# EAGLE design v_1.0 (EAGLE 9.4.2)
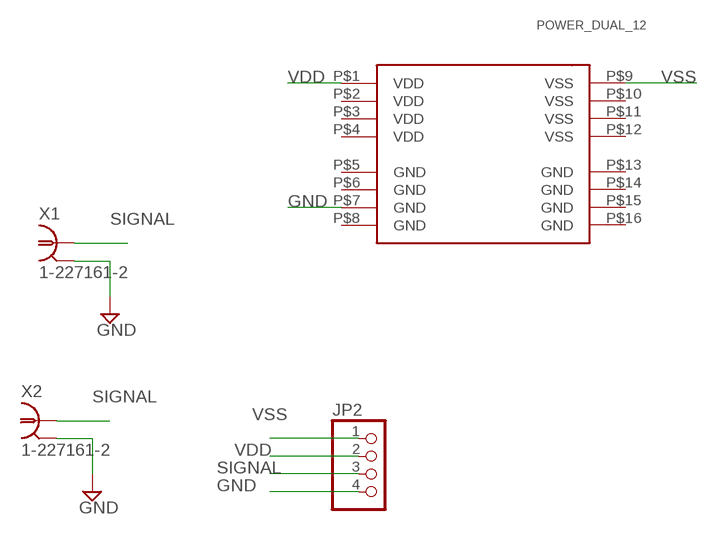
[diagram p0: schematic, sheet 1]

## Parts
JP2  PINHD-1X4  [1X04]
U$1  POWER_DUAL_12  [MODULE_4X8]
X1  1-227161-2  [AMP_227161]
X2  1-227161-2  [AMP_227161]

## Nets
GND: JP2.4 U$1.P$7(GND) X1.2 X2.2
SIGNAL: JP2.3 X1.1 X2.1
VDD: JP2.2 U$1.P$1(VDD)
VSS: JP2.1 U$1.P$9(VSS)
Unconnected: U$1.P$2(VDD) U$1.P$3(VDD) U$1.P$4(VDD) U$1.P$5(GND) U$1.P$6(GND) U$1.P$8(GND) U$1.P$10(VSS) U$1.P$11(VSS) U$1.P$12(VSS) U$1.P$13(GND) U$1.P$14(GND) U$1.P$15(GND) U$1.P$16(GND)

## Library data of the parts
JP2 = pinhead:PINHD-1X4: PIN HEADER
U$1 = uguz_cEGG:POWER_DUAL_12
X1 X2 = con-coax:?227161*: JACK, RIGHT ANGLE, 50 OHM, PCB, BNC Source: amp_227161.pdf; OC_FARNELL: unknown; OC_NEWARK: unknown

## Board
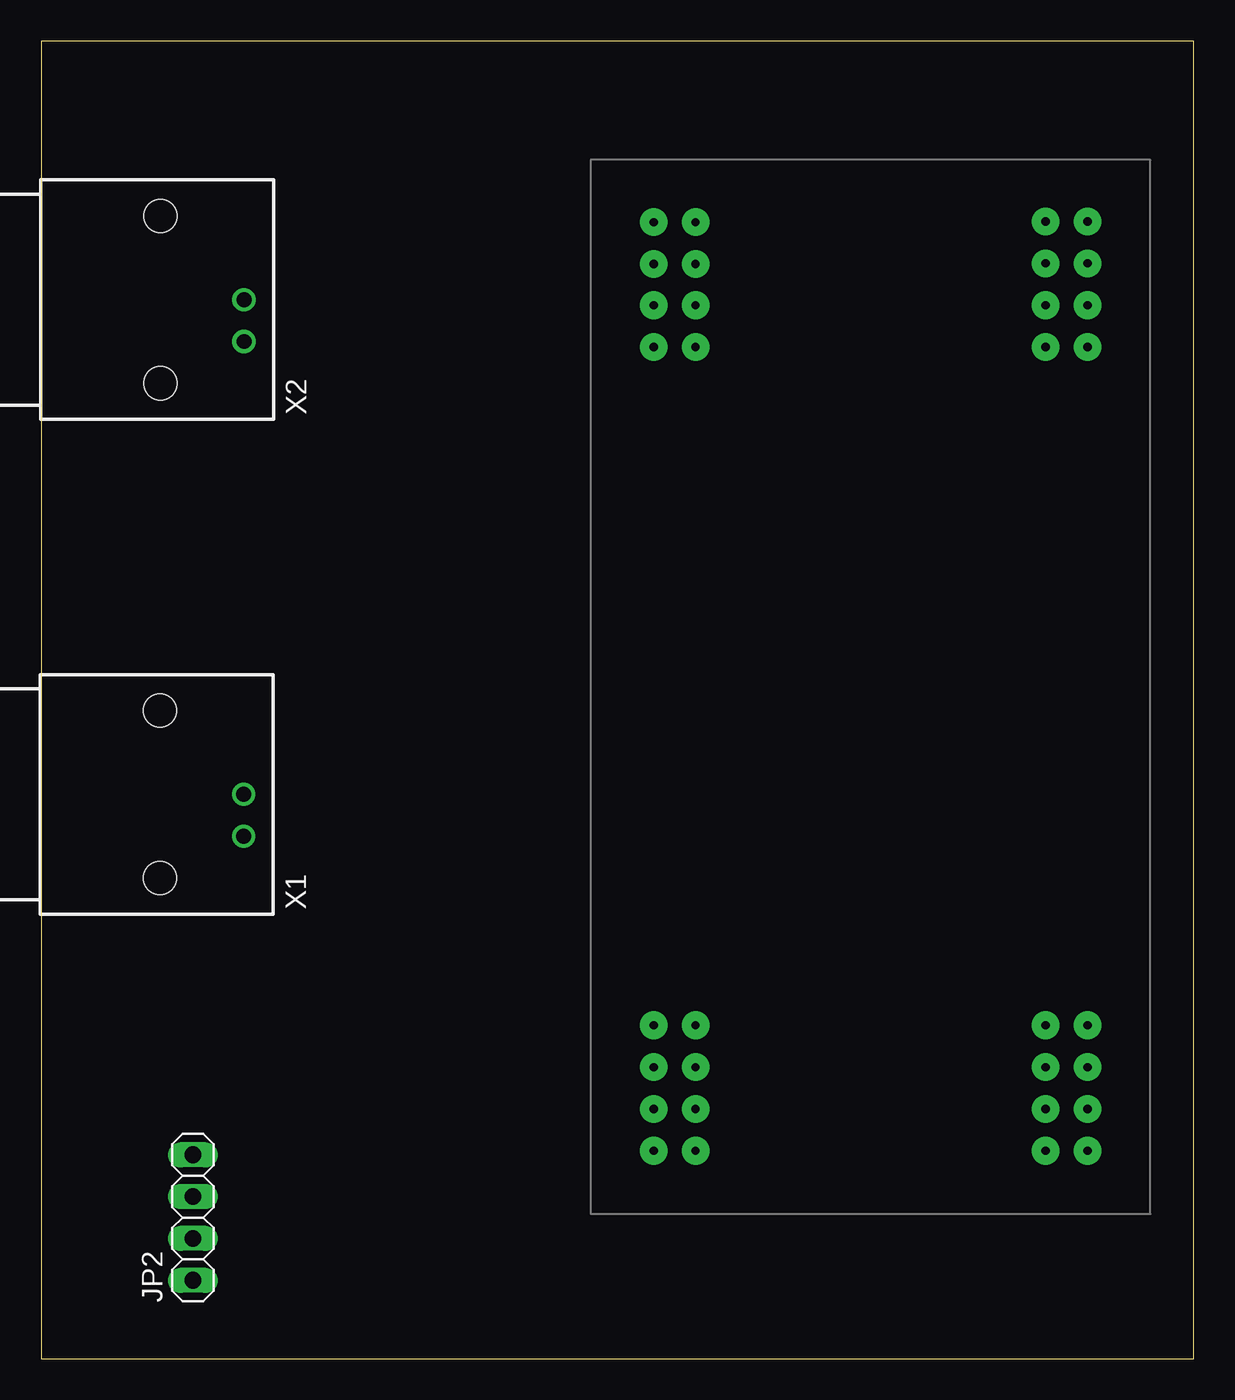
[diagram p1: board, top side]
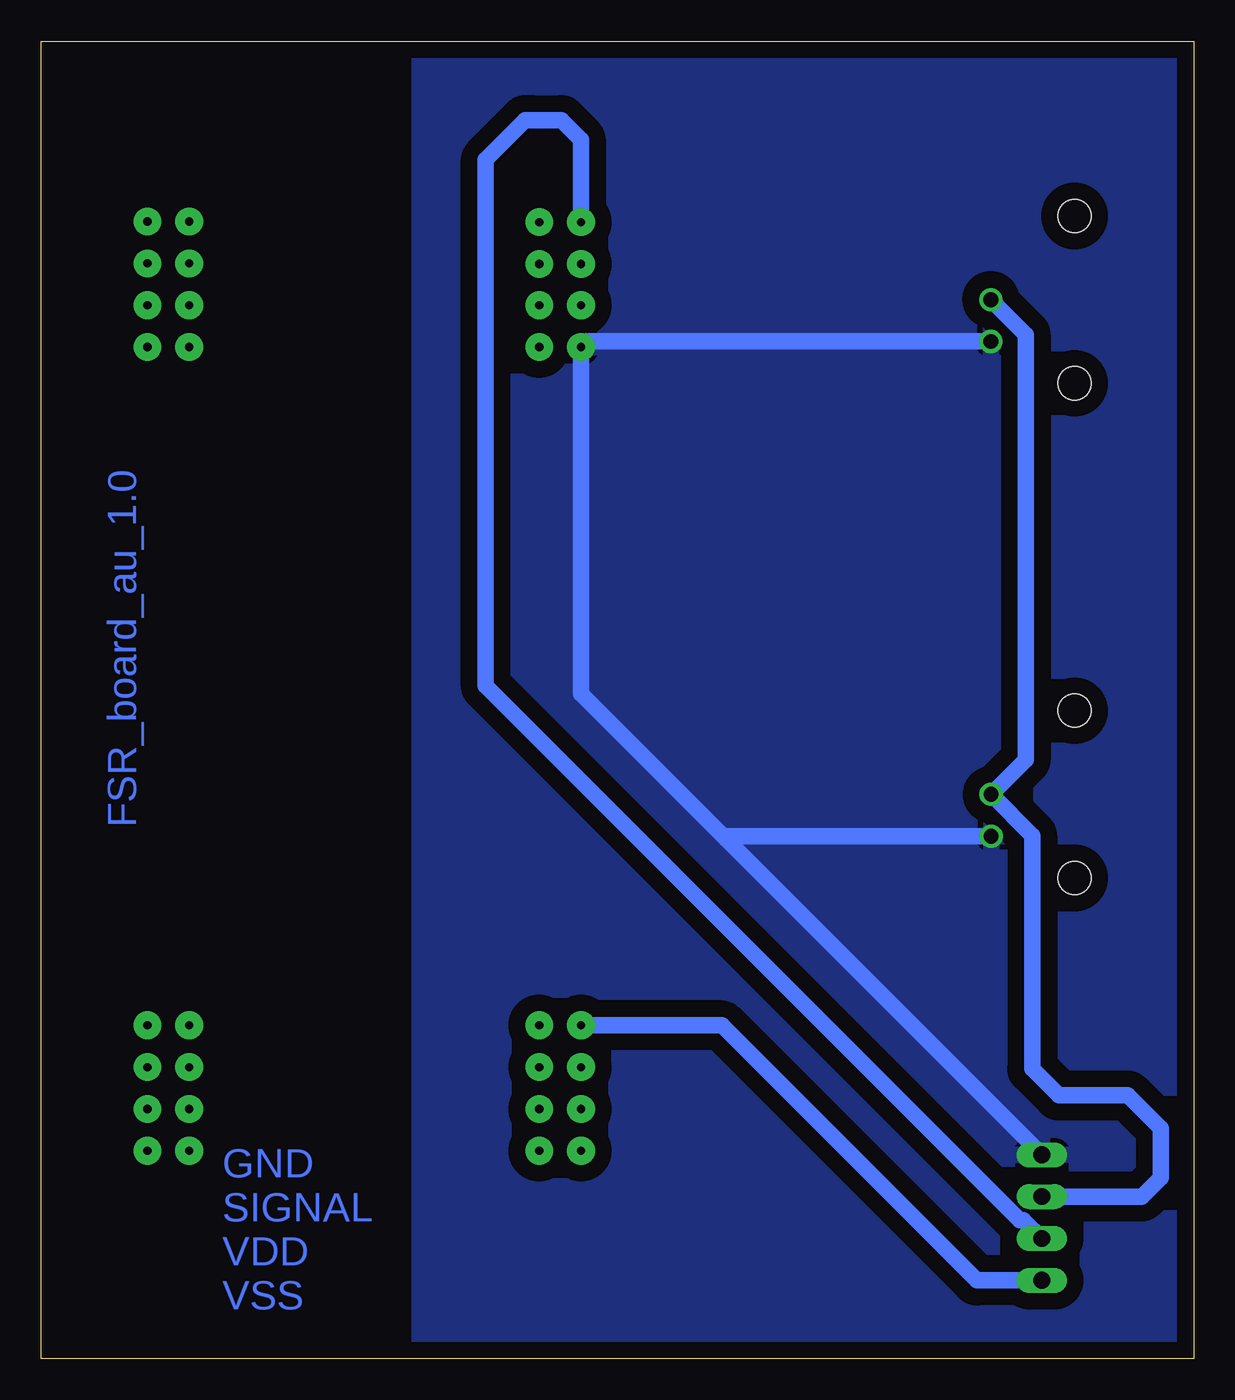
[diagram p2: board, bottom side, seen from below]

Size 70 x 80 mm. Coordinates in mm from the lower left corner, seen from the top.
Outline: 0,0 70,0 70,80 0,80 0,0
Copper layers (1*16): Top 0.035mm / dielectric 1.5mm / Bottom 0.035mm
Design rules "default": minimum track width 6mil, minimum drill 0.35mm, track to track 6mil, track to pad 6mil, pad to pad 6mil, via to via 6mil, smd to smd 6mil, copper to edge 40mil, drill to drill 6mil, minimum pad ring 10mil, minimum via ring 8mil, stop-mask expansion 4mil, vias tented up to drill 0mil, thermal gap 10mil

### Footprints (pad centres in the part's own frame; a part is rotated, then mirrored left to right if it is on the bottom)
1X04 = drill 1.016 long: 1 -3.81,0; 2 -1.27,0; 3 1.27,0; 4 3.81,0
MODULE_4X8 = drill 0.5 pad 1.676: P$1 -28.21,-13.17; P$2 -28.21,-10.63; P$3 -25.67,-13.17; P$4 -25.67,-10.63; P$5 -23.17,-13.17; P$6 -23.17,-10.63; P$7 -20.63,-13.17; P$8 -20.63,-10.63; P$9 20.55,-13.17; P$10 20.55,-10.63; P$11 23.09,-13.17; P$12 23.09,-10.63; P$13 25.63,-13.17; P$14 25.63,-10.63; P$15 28.17,-13.17; P$16 28.17,-10.63; P$17 -28.25,10.63; P$18 -28.25,13.17; P$19 -25.71,10.63; P$20 -25.71,13.17; P$21 -23.17,10.63; P$22 -23.17,13.17; P$23 -20.63,10.63; P$24 -20.63,13.17; P$25 20.55,10.63; P$26 20.55,13.17; P$27 23.09,10.63; P$28 23.09,13.17; P$29 25.63,10.63; P$30 25.63,13.17; P$31 28.17,10.63; P$32 28.17,13.17
AMP_227161 = drill 0.9 pad 1.27: 1 0,-5.08; 2 -2.54,-5.08 | hole 2: -5.08,0; 5.08,0

### Placement (x,y rotation side)
JP2  9.22,8.58 90 top
U$1  50.38,40.8 270 top
X1  7.22,34.27 90 top
X2  7.24,64.31 90 top

### Tracks (layer width: path | path; a pad name or v marks a point on that pad's centre or on a via)
GND
  Bottom 1.016: 28.41,31.59 37.21,40.38 U$1.P$7 36.87,61.77 X2.2 | 28.41,31.59 JP2.4 | X1.2 28.27,31.73 28.41,31.59
  pour Bottom (isolate 1.016): 1,80 47,80 47,-1 0,-1 0,0 0,80
SIGNAL
  Bottom 1.016: X2.1 10.2,62.19 10.2,36.37 X1.1 9.8,31.77 9.8,17.6 8.2,16 4,16 2,14 2,11 3.15,9.85 JP2.3
VDD
  Bottom 1.016: JP2.2 10.34,8.43 10.57,8.43 43,40.86 43,72.8 40.6,75.2 40.2,75.2 38.4,75.2 37.21,74.01 U$1.P$1
VSS
  Bottom 1.016: JP2.1 13.17,4.77 28.65,20.25 U$1.P$9

### Text on the board
Bottom: FSR_board_au_1.0 | GND / SIGNAL / VDD / VSS